# EAGLE design Sch (EAGLE 6.4)
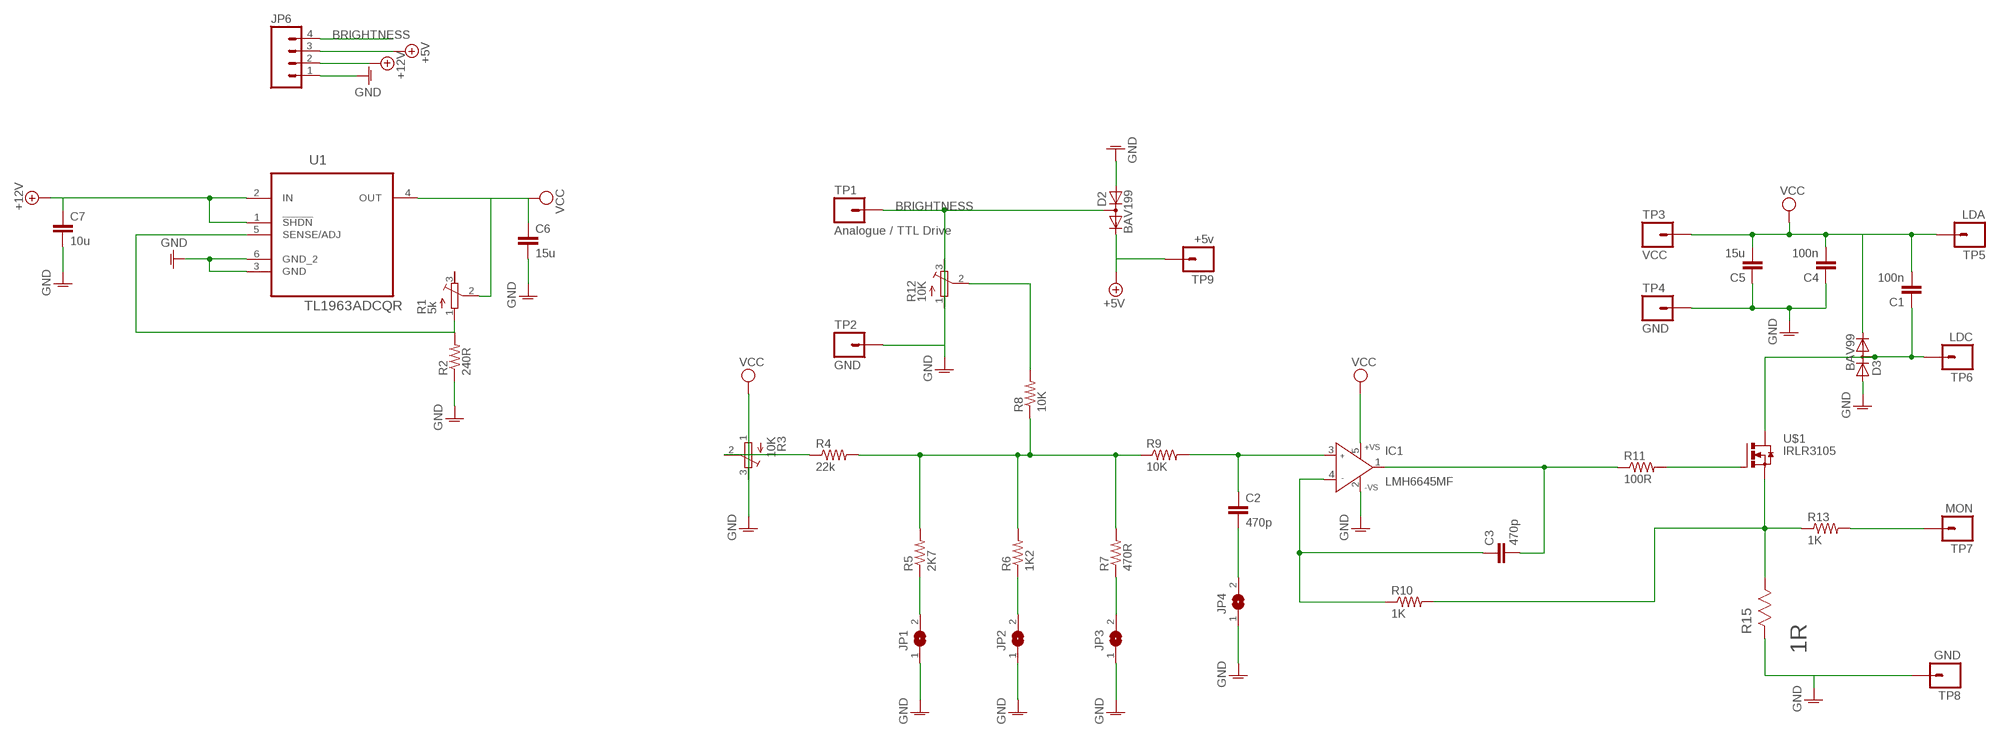
[diagram p0: schematic, sheet 1]

## Parts
C1  100n  CAP1206  [1206]
C2  470p  CAP1206  [1206]
C3  470p  CAP1206  [1206]
C4  100n  CAP1206  [1206]
C5  15u  CAP1206  [1206]
C6  15u  CAP1206  [1206]
C7  10u  CAP1206  [1206]
D2  BAV199  [SOT23]
D3  BAV99  BAV199  [SOT23]
IC1  LMH6645MF  AD8067  [SOT23-5]
JP1  SJ  [SJ]
JP2  SJ  [SJ]
JP3  SJ  [SJ]
JP4  SJ  [SJ]
JP6  M04PTH  [1X04]
R1  5k  R-TRIMM64W  [RTRIM64W]
R2  240R  RESISTOR0603-RES  [0603-RES]
R3  10K  R-TRIMM5X  [RTRIM5X]
R4  22k  RESISTOR0603-RES  [0603-RES]
R5  2K7  RESISTOR0603-RES  [0603-RES]
R6  1K2  RESISTOR0603-RES  [0603-RES]
R7  470R  RESISTOR0603-RES  [0603-RES]
R8  10K  RESISTOR0603-RES  [0603-RES]
R9  10K  RESISTOR0603-RES  [0603-RES]
R10  1K  RESISTOR0603-RES  [0603-RES]
R11  100R  R-US_R0603  [R0603]
R12  10K  R-TRIMM5X  [RTRIM5X]
R13  1K  RESISTOR0603-RES  [0603-RES]
R15  1R  CRM2010-JW-1R0ELF  [RESC5025X71N]
TP1  Analogue / TTL Drive  M01PTH  [1X01]
TP2  GND  M01PTH  [1X01]
TP3  VCC  M01PTH  [1X01]
TP4  GND  M01PTH  [1X01]
TP5  LDA  M01PTH_LONGPAD  [1X01_LONGPAD]
TP6  LDC  M01PTH_LONGPAD  [1X01_LONGPAD]
TP7  MON  M01PTH  [1X01]
TP8  GND  M01PTH  [1X01]
TP9  +5v  M01PTH  [1X01]
U1  TL1963ADCQR  [SOT127P700X180-6N]
U$1  IRLR3105  [TO252AA-LARGE]

## Nets
+5V: D2.2(C) JP6.3 TP9.1
+12V: C7.1 JP6.2 U1.1(!SHDN) U1.2(IN)
BRIGHTNESS: D2.3(AC) JP6.4 R12.1(E) TP1.1
GNDA: C4.1 C5.1 C6.2 C7.2 D2.1(A) D3.1(A) IC1.2(-VS) JP1.1 JP2.1 JP3.1 JP4.1 JP6.1 R2.1 R3.1(E) R12.3(A) R15.2(R2) TP2.1 TP4.1 TP8.1 U1.3(GND) U1.6(GND_2) ; supply symbol labelled GND
N$2: R8.2 R12.2(S)
N$3: R3.2(S) R4.1
N$4: R4.2 R5.2 R6.2 R7.2 R8.1 R9.1
N$5: JP1.2 R5.1
N$6: JP2.2 R6.1
N$7: JP3.2 R7.1
N$8: C2.2 JP4.2
N$9: C2.1 IC1.3(IN+) R9.2
N$10: C3.1 IC1.4(IN-) R10.1
N$11: C3.2 IC1.1(OUT) R11.1
N$12: R11.2 U$1.P$1(G)
N$14: C1.1 D3.3(AC) TP6.1 U$1.P$3(D)
N$15: R10.2 R13.1 R15.1(R1) U$1.P$2(S)
N$16: R1.1(E) R2.2 U1.5(SENSE/ADJ)
N$17: R13.2 TP7.1
VCC: C1.2 C4.2 C5.2 C6.1 D3.2(C) IC1.5(+VS) R1.2(S) R3.3(A) TP3.1 TP5.1 U1.4(OUT)
Unconnected: R1.3(A)

## Library data of the parts
C1-C7 = SparkFun-Passives:CAP: Capacitor Standard 0603 ceramic capacitor, and 0.1" leaded capacitor.
D2 D3 = diode:BAV199: DIODE low-leakage double diode
IC1 = analog-devices:AD8067: High Gain Bandwidth, Precision Fast FET(TM) Op Amp Source: http://www.analog.com/UploadedFiles/Data_Sheets/346131962AD8067_a.pdf; MF: ALTERA CORPORATION; MPN: AD8067ARTZ-REEL7; OC_FARNELL: 1464848; OC_NEWARK: 59K6326
JP1-JP4 = jumper:SJ: SMD solder JUMPER
JP6 = SparkFun-Connectors:M04: Header 4 Standard 4-pin 0.1" header. Use with straight break away headers (SKU : PRT-00116), right angle break away headers (PRT-00553), swiss pins (PRT-00743), machine pins (PRT-00117), and female headers (PRT-00115). Molex polarized connector foot print use with SKU : PRT-08231 with associated crimp pins and housings. 1MM SMD Version SKU: PRT-10208
R1 R3 R12 = resistor:R-TRIMM: Trimm resistor
R2 R4-R10 R13 = SparkFun-Passives:RESISTOR: Resistor Basic schematic elements and footprints for 0603, 1206, and PTH resistors.
R11 = resistor:R-US_: RESISTOR, American symbol
R15 = EagleParts:CRM2010-JW-1R0ELF: Resistor 2010; MPN: CRM2010-JW-1R0ELF; OC_FARNELL: 1865252; OC_NEWARK: 17T4283; SUPPLIER: BOURNS; TOLERANCE: ±5 %; VALUE: 1 Ohm; WATTAGE: 1 W
TP1-TP9 = SparkFun-Connectors:M01: Header 1 Standard 1-pin 0.1" header. Use with straight break away headers (SKU : PRT-00116), right angle break away headers (PRT-00553), swiss pins (PRT-00743), machine pins (PRT-00117), and female headers (PRT-00115).
U1 = EagleParts:TL1963ADCQR: IC, LDO REG, ADJ, 1.5A, 6-SOT-223; MPN: TL1963ADCQR; OC_FARNELL: 2323630; OC_NEWARK: 94T5084; PACKAGE: 6-SOT-223; SUPPLIER: TEXAS INSTRUMENTS
U$1 = transistor-power:IRLR3105

## Net classes
0 default: clearance 0.254 mm

## Board
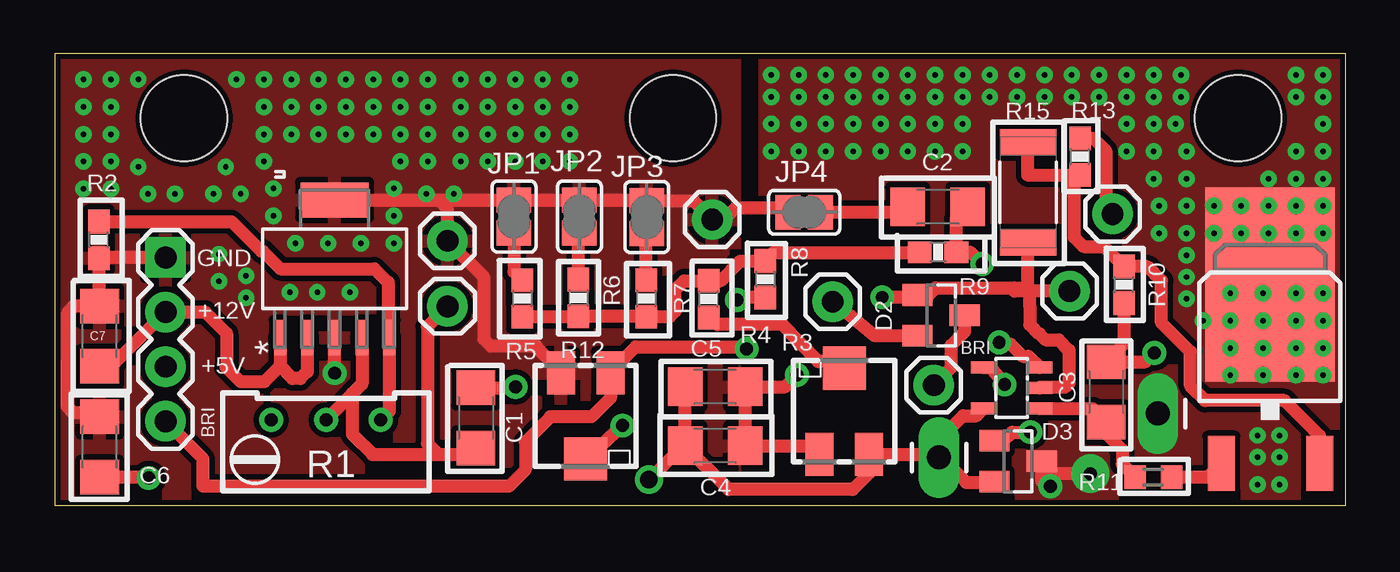
[diagram p1: board, top side]
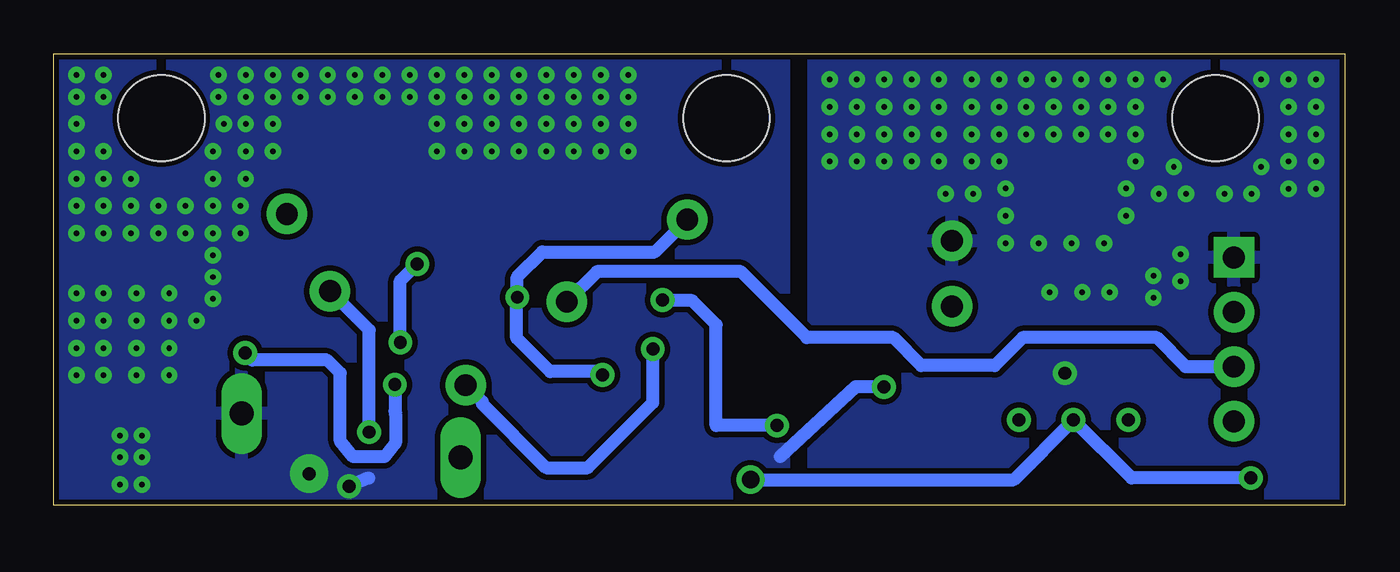
[diagram p2: board, bottom side, seen from below]

Size 60 x 21 mm. Coordinates in mm from the lower left corner, seen from the top.
Outline: 0,0 60,0 60,21 0,21 0,0
Copper layers (1*16): Top 0.035mm / dielectric 1.5mm / Bottom 0.035mm
Design rules "pcbtrain": minimum track width 0.2mm, minimum drill 0.4mm, track to track 0.2mm, track to pad 0.2mm, pad to pad 0.2mm, via to via 0.2mm, smd to smd 0mil, copper to edge 10mil, drill to drill 0.2mm, minimum pad ring 10mil, minimum via ring 10mil, stop-mask expansion 0.125mm, vias tented up to drill 0mil, thermal gap 10mil
Holes 4 mm at 6,18 28.73,18 55,18

### Footprints (pad centres in the part's own frame; a part is rotated, then mirrored left to right if it is on the bottom)
1206 = smd 1.6 x 1.8: 1 -1.4,0; 2 1.4,0
SOT23 = smd 1 x 1.4: 1 -0.95,-1.1; 2 0.95,-1.1; 3 0,1.1
SOT23-5 = smd 0.55 x 1.2: 1 -0.95,-1.3; 2 0,-1.3; 3 0.95,-1.3; 4 0.95,1.3; 5 -0.95,1.3
SJ = smd 1.168 x 1.6: 1 -0.762,0; 2 0.762,0
1X04 = drill 1.016 pad 1.88 square: 1 0,0 | drill 1.016 pad 1.88: 2 2.54,0; 3 5.08,0; 4 7.62,0
RTRIM64W = drill 0.61: 1 1.27,-2.54; 2 1.27,0; 3 1.27,2.54
0603-RES = smd 1.1 x 1: 1 -0.85,0; 2 0.85,0
RTRIM5X = smd 1.3 x 2: 1 -1.15,-2; 3 1.15,-2 | smd 2 x 2: 2 0,2
R0603 = smd 1 x 1.1: 1 -0.85,0; 2 0.85,0
RESC5025X71N = smd 1.194 x 2.642: 1 -2.337,0; 2 2.337,0
1X01 = drill 1.016 pad 1.88: 1 0,0
1X01_LONGPAD = drill 1.118 pad 1.88 long: 1 0,0
SOT127P700X180-6N = smd 1.626 x 0.559: 1 -3.2,2.54; 2 -3.2,1.27; 3 -3.2,0; 4 -3.2,-1.27; 5 -3.2,-2.54 | smd 1.626 x 3.175: 6 3.2,0
TO252AA-LARGE = smd 1.27 x 2.54: P$1 -2.261,-6.325; P$2 2.311,-6.325 | smd 6 x 9: P$3 0,2

### Placement (x,y rotation side)
C1  19.57,4.06 270 top
C2  41.04,13.88 180 top
C3  48.86,5.27 270 top
C4  30.69,2.78 180 top
C5  30.69,5.52 180 top
C6  2.09,2.71 90 top
C7  2.08,7.86 90 top
D2  41.19,8.83 270 top
D3  44.76,2.05 270 top
IC1  44.48,5.46 90 top
JP1  21.34,13.43 270 top
JP2  24.38,13.43 270 top
JP3  27.51,13.4 270 top
JP4  34.83,13.63 0 top
JP6  5.14,11.53 270 top
R1  12.6,2.7 90 top
R2  2.04,12.35 90 top
R3  36.69,4.38 0 top
R4  30.39,9.59 90 top
R5  21.72,9.62 270 top
R6  24.33,9.65 270 top
R7  27.49,9.62 270 top
R8  33.01,10.51 270 top
R9  41.05,11.78 0 top
R10  49.69,10.26 90 top
R11  51.06,1.32 0 top
R12  24.67,4.15 180 top
R13  47.65,16.22 90 top
R15  45.24,14.55 270 top
TP1  40.85,5.59 90 top
TP2  47.16,9.96 90 top
TP3  18.25,9.25 270 top
TP4  30.55,13.29 90 top
TP5  41.1,2.23 180 top
TP6  51.28,4.27 0 top
TP7  49.16,13.55 270 top
TP8  18.25,12.3 90 top
TP9  36.16,9.47 90 top
U1  13,11 90 top
U$1  56.48,8.27 0 top

### Tracks (layer width: path | path; a pad name or v marks a point on that pad's centre or on a via)
+5V
  Top 0.61: D2.2 38.1,7.88 TP9.1
  Bottom 0.61: JP6.3 7.38,6.45 8.74,7.8 14.96,7.8 16.26,6.5 19.68,6.5 20.98,7.8 24.99,7.8 28.07,10.87 34.75,10.87 TP9.1
+12V
  Top 0.61: U1.1 10.46,6.47 | 10.46,6.47 9.73,5.74 8.64,5.74 7.95,6.43 7.98,6.45 7.98,8 6.99,8.98 JP6.2 2.62,6.46 C7.1 | U1.2 11.73,6.22 11.4,5.89 11.04,5.89 10.46,6.47
BRIGHTNESS  (via drill 0.6)
  Top 0.61: D2.3 42.29,8.07 41.66,7.44 41.66,6.39 TP1.1 | JP6.4 6.89,2.16 6.89,0.89 21.11,0.89 21.87,1.65 21.87,2.95 23.04,4.12 24.94,4.12 25.82,4.99 R12.1 26.12,6.15 26.12,6.48 27,7.37 32.05,7.37 v32.16,7.26
  Bottom 0.61: TP1.1 40.09,4.83 40.09,4.73 37.11,1.75 35.18,1.75 32.16,4.78 v32.16,7.26
GNDA  (via drill 0.25, 0.6)
  Top 0.61: U1.6 17.83,14.2 | v38.46,9.68 39.98,9.68 D2.1 40.62,9.78 40.95,10.11 44.61,10.11 | R3.1 35.14,2.78 C4.1 C5.1 33.94,5.52 v34.49,6.07 34.45,6.02 | IC1.2 45.81,5.49 46.94,5.49 47.14,5.69 47.14,7.21 46.66,7.7 46.05,7.7 45.77,7.98 45.74,7.98 45.31,8.41 45.31,9.26 45.31,9.84 45.19,9.96 | TP2.1 45.19,9.96 | 45.19,9.96 44.61,9.96 44.61,10.11 | D3.1 44.09,3 44.5,3.4 v45.34,3.4 | JP6.1 2.07,11.53 R2.1 2.04,9.31 C7.2 0.88,9.26 0.58,8.91 0.56,4.62 0.84,4.32 1.88,4.32 C6.2 | v13.01,6.15 U1.3 | 17.83,14.2 18.25,13.78 TP8.1 19.94,10.61 19.94,7.72 20.27,7.39 22.38,7.39 23.52,6.25 R12.3 | 17.83,14.2 JP1.1 JP2.1 27.49,14.19 JP3.1 29.68,14.17 TP4.1 31.1,13.29 31.65,13.84 33.85,13.84 JP4.1 | 44.61,10.11 45.24,10.11 R15.2
  Bottom 0.61: v34.49,6.07 34.49,6.22 36.93,6.22 38.48,7.77 38.48,9.65 v38.46,9.68 38.46,10.62 37.29,11.79 32.06,11.79 TP4.1 | v45.34,3.4 45.34,8.14 TP2.1
  other vias: 11.18,12.19 12.7,12.19 14.22,12.19 15.75,12.19 10.92,9.91 12.19,9.91 13.72,9.91 15.75,13.46 15.75,14.73 17.27,14.48 18.54,14.48 10.16,14.73 10.16,13.46 8.64,14.48 7.37,14.48 5.59,14.48 4.32,14.48 7.62,11.68 7.62,10.41 8.89,10.67 8.89,9.65 1.33,14.72 1.33,15.99 1.33,17.26 1.33,18.53 1.33,19.8 2.6,19.8 2.6,18.53 2.6,17.26 2.6,15.99 2.6,14.72 3.87,15.73 7.94,15.73 3.87,19.8 8.45,19.8 9.72,19.8 10.99,19.8 12.26,19.8 13.53,19.8 14.8,19.8 16.07,19.8 17.34,19.8 18.86,19.8 20.13,19.8 21.4,19.8 22.67,19.8 23.94,19.8 23.94,18.53 22.67,18.53 21.4,18.53 20.13,18.53 18.86,18.53 17.34,18.53 16.07,18.53 14.8,18.53 13.53,18.53 12.26,18.53 10.99,18.53 9.72,18.53 9.72,17.26 9.72,15.99 10.99,17.26 12.26,17.26 13.53,17.26 14.8,17.26 16.07,17.26 17.34,17.26 18.86,17.26 20.13,17.26 21.4,17.26 22.67,17.26 23.94,17.26 23.94,15.99 22.67,15.99 21.4,15.99 20.13,15.99 18.86,15.99 17.34,15.99 16.07,15.99
  pour Top: 31.6,21 31.6,-0.84 -0.94,-0.84 -0.94,21
  pour Bottom: 24.69,21 24.69,-0.84 -0.94,-0.84 -0.94,21
N$2  (via drill 0.6)
  Top 0.61: R12.2 24.71,2.15 v26.39,3.71 | R8.2 31.81,9.66 v31.7,9.55
  Bottom 0.61: v26.39,3.71 29.21,3.71 29.21,8.41 30.33,9.53 31.67,9.53 v31.7,9.55
N$3
  Top 0.61: R3.2 36.38,6.69 35.48,6.69 33.81,8.41 30.82,8.41 R4.1
N$4
  Top 0.61: R9.1 40.16,11.73 33.38,11.73 R8.1 31.85,11.35 30.94,10.44 R4.2 30.44,10.44 29.26,10.44 28.83,10.01 28.83,9.02 28.59,8.77 R7.2 27.46,8.8 R6.2 24.31,8.77 R5.2
N$5
  Top 0.61: JP1.2 21.34,10.86 R5.1
N$6
  Top 0.61: R6.1 24.33,12.62 JP2.2
N$7
  Top 0.61: R7.1 27.49,12.62 JP3.2
N$8
  Top 0.61: JP4.2 39.38,13.63 C2.2
N$9  (via drill 0.6)
  Top 0.61: C2.1 41.9,13.35 R9.2 42.55,11.78 v43.1,11.23 | v43.89,7.57 43.82,7.5 44.42,7.5 44.98,6.93 45.25,6.93 IC1.3
  Bottom 0.61: v43.89,7.57 43.89,10.44 v43.1,11.23
N$10  (via drill 0.6)
  Top 0.61: R10.1 49.7,7.5 C3.1 50.69,6.67 v51.1,7.09 | IC1.4 43.48,6.41 v44.15,5.61
  Bottom 0.61: v44.15,5.61 44.15,4.37 44.12,4.24 44.12,2.9 44.63,2.26 46.08,2.26 46.69,3 46.69,6.15 47.3,6.76 50.77,6.76 v51.1,7.09
N$11
  Top 0.61: R11.1 49.61,1.92 49.61,2.59 48.87,3.33 C3.2 48.23,4.51 IC1.1
N$12
  Top 0.61: R11.2 53.59,1.32 U$1.P$1
N$14  (via drill 0.25, 0.6, 0.6 pad 1.78)
  Top 0.61: C1.1 21.36,5.46 v21.41,5.51 | v46.28,0.89 45.86,1.13 D3.3 46.44,1.47 v48.13,1.47
  Bottom 0.61: v21.41,5.51 22.73,5.51 26.24,2.26 | 45.36,1.27 v46.28,0.89
  other vias: 57.68,13.92 56.41,13.92 55.14,13.92 53.87,13.92 52.6,13.92 51.33,13.92 58.95,13.92 51.33,12.65 52.6,12.65 53.87,12.65 55.14,12.65 56.41,12.65 57.68,12.65 58.95,12.65 52.6,11.63 52.6,10.62 52.6,9.6 55.91,0.97 56.92,0.97 55.91,2.24 56.92,2.24 56.92,3.25 55.91,3.25 54.64,9.86 56.16,9.86 57.68,9.86 54.64,8.59 54.64,7.32 56.16,7.32 56.16,8.59 57.68,8.59 57.68,7.32 58.95,9.86 58.95,8.59 58.95,7.32 58.95,6.05 57.68,6.05 56.16,6.05 54.64,6.05 53.37,8.59 58.95,15.19 57.68,15.19 56.41,15.19 52.6,15.19 51.08,15.19 58.95,16.46 57.68,16.46 58.95,17.73 58.95,19 58.95,20.02 57.68,20.02 57.68,19 52.6,16.46 51.08,16.46 51.08,17.73 51.08,19 51.08,20.02 52.35,20.02 52.35,19 52.1,17.73 49.81,16.46 42.19,16.46 40.92,16.46 39.65,16.46 38.38,16.46 37.11,16.46 35.84,16.46 34.57,16.46 33.3,16.46 33.3,17.73 33.3,19 33.3,20.02 34.57,20.02 34.57,19 34.57,17.73 35.84,17.73 37.11,17.73 38.38,17.73 39.65,17.73 40.92,17.73 42.19,17.73 49.81,17.73 49.81,19 48.54,19 47.27,19 46,19 44.73,19 43.46,19 42.19,19 40.92,19 39.65,19 38.38,19 37.11,19 35.84,19 35.84,20.02 37.11,20.02 38.38,20.02 39.65,20.02 40.92,20.02 42.19,20.02 43.46,20.02 44.73,20.02 46,20.02 47.27,20.02 48.54,20.02 49.81,20.02
  pour Top (no thermals): 32.99,21 32.99,-0.84 60.96,-0.84 60.96,21
  pour Bottom: 60.96,21 60.96,-0.84 26.06,-0.84 26.06,21
N$15
  Top 0.61: U$1.P$2 58.79,3.23 57.15,4.88 53.47,4.88 52.78,5.56 52.78,7.14 51.44,8.48 51.44,10.44 50.77,11.1 49.7,11.1 R10.2 48.76,12.04 47.8,12.04 47.37,12.47 47.37,14.73 47.27,14.73 47.27,15.37 R13.1 45.21,15.37 45.21,16.89 R15.1
N$16
  Top 0.61: R1.1 15.54,4.37 U1.5 15.49,7.85 15.49,10.36 14.86,11 10.49,11 9.68,11.81 9.6,11.81 8.22,13.2 R2.2
  Bottom 0.61: R1.1
N$17
  Top 0.61: 48.94,13.77 TP7.1 48.84,13.87 48.84,16.48 48.26,17.07 R13.2
VCC  (via drill 0.6, 0.8)
  Top 0.61: U1.4 14.28,5.64 | 14.28,5.64 R1.2 | 14.28,5.64 14.26,5.64 13.82,5.21 13.82,3.3 14.76,2.36 17.83,2.36 | 17.83,2.36 19.27,2.36 C1.2 | 17.83,2.36 17.32,2.87 17.32,8.32 TP3.1 | C4.2 31.33,0.74 37.08,0.74 37.84,1.49 R3.3 40.74,2.38 TP5.1 | C4.2 C5.2 | TP5.1 41.41,2.02 42.37,1.07 43.63,1.07 D3.2 | TP5.1 41.1,3.05 42.22,4.17 42.84,4.17 IC1.5 | C6.1 4.33,1.31 v4.37,1.27 | C4.2 29.19,2.78 v27.61,1.19
  Bottom 0.61: v4.37,1.27 9.9,1.27 R1.2 15.38,1.19 v27.61,1.19

### Text on the board
tPlace: GND | +12V | BRI | +5V | BRI